# Altium schematic sheet IC.SchDoc
size A3; Organization: Altium Limited; Address1: L3, 12a Rodborough Rd; Address2: Frenchs Forest; Address3: NSW; Address4: Australia 2086
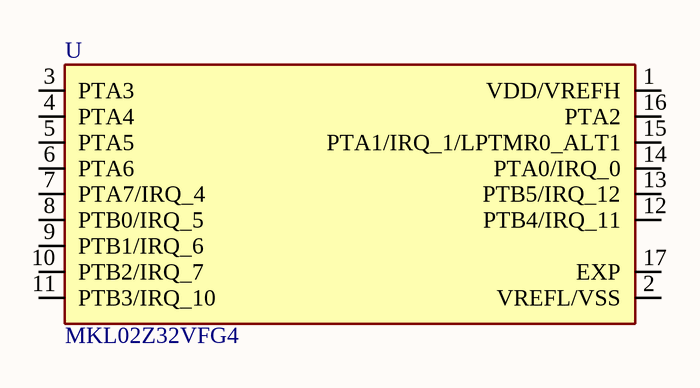
[diagram p0: IC.SchDoc]

## Parts
U  MKL02Z32VFG4  [QFN50P300X300X65-17N]

## Nets

Not connected (* = marked no-connect by the designer): U 1(VDD/VREFH) 2(VREFL/VSS) 3(PTA3) 4(PTA4) 5(PTA5) 6(PTA6) 7(PTA7/IRQ_4) 8(PTB0/IRQ_5) 9(PTB1/IRQ_6) 10(PTB2/IRQ_7) 11(PTB3/IRQ_10) 12(PTB4/IRQ_11) 13(PTB5/IRQ_12) 14(PTA0/IRQ_0) 15(PTA1/IRQ_1/LPTMR0_ALT1) 16(PTA2) 17(EXP)

## Notes on the sheet
- Title
- Size:
- Date:
- A3
- Number:
- Time:
- Revision:
- Sheet
- of
- File:

## Library data of the parts
U = MKL02Z32VFG4: ARMÂ®CortexÂ®-M0+ Kinetis KL02å¾®æŽ§åˆ¶å™¨IC 32ä½48MHz 32KBï¼ˆ32K x 8ï¼‰é—ªå­˜16-QFNï¼ˆ3x3ï¼‰; MF: NXP USA; Availability: Unavailable; MP: MKL02Z32VFG4; Price: None; Value: *; SnapEDA_Link: https://www.snapeda.com/parts/MKL02Z32VFG4/NXP%20USA%20Inc./view-part/492537/?ref=snap; Package: QFN-16 NXP Semiconductors